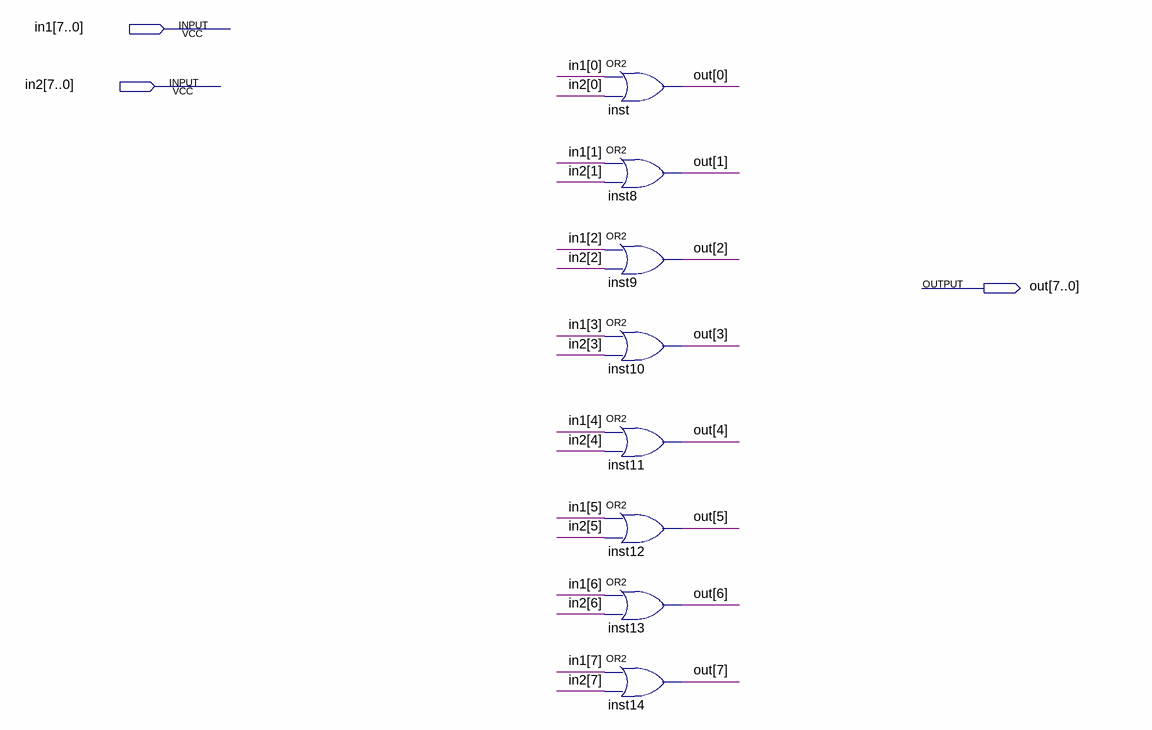
[diagram p0: schematic sheet]
// Quartus schematic ORByte.bdf as structural Verilog: 8 symbols, 3 pins
module ORByte (
  input  [7:0] in1,
  input  [7:0] in2,
  output [7:0] out
);

  or inst (out[0], in1[0], in2[0]);
  or inst8 (out[1], in1[1], in2[1]);
  or inst9 (out[2], in1[2], in2[2]);
  or inst10 (out[3], in1[3], in2[3]);
  or inst11 (out[4], in1[4], in2[4]);
  or inst12 (out[5], in1[5], in2[5]);
  or inst13 (out[6], in1[6], in2[6]);
  or inst14 (out[7], in1[7], in2[7]);
endmodule
